# Altium schematic sheet Regulator.SchDoc: Regulator
size A4; Organization: Energy Auditor; Address1: Sensor Node; Address3: University of Colorado; Address4: Boulder; DocumentNumber: 3; Revision: 1; SheetNumber: 3; SheetTotal: 6
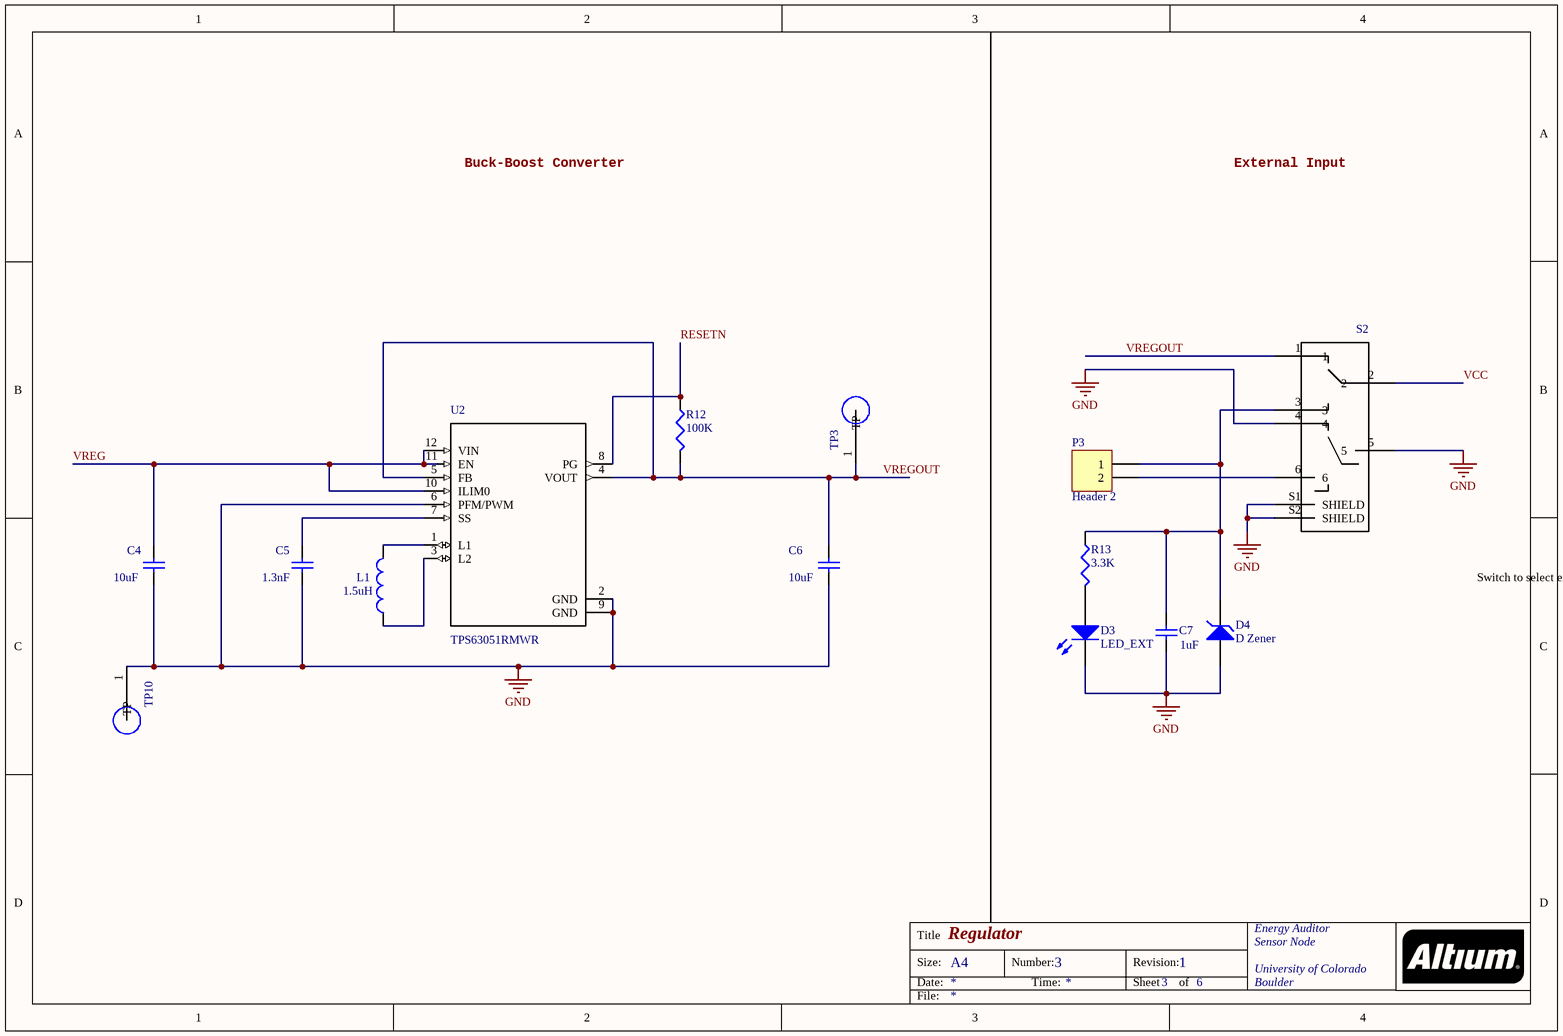
[diagram p0: Regulator.SchDoc]

## Parts
C4  10uF  [1608[0603]]
C5  1.3nF  [1608[0603]]
C6  10uF  [1608[0603]]
C7  1uF  [1608[0603]]
D3  LED_EXT  [3.2X1.6X1.1]
D4  D Zener  [0402]
L1  1.5uH  [0603]
P3  Header 2  [HDR1X2]
R12  100K  [1608[0603]]
R13  3.3K  [1608[0603]]
S2  1825289-1  [SW_1825289-1_1825289-1(Primary)]  (value not drawn)
TP3  5019  [TP380X203]  (value not drawn)
TP10  5019  [TP380X203]  (value not drawn)
U2  TPS63051RMWR  [QFN50P250X250X100-12N]

## Nets
GND: C4.1 C5.1 C6.1 C7.1 D3.2(K) D4.1(A) S2.4 S2.5 S2.S1(SHIELD) S2.S2(SHIELD) TP10.1(TP) U2.2(GND) U2.6(PFM/PWM) U2.9(GND)
RESETN: R12.1 U2.8(PG)
VCC: S2.2
VREG: C4.2 U2.10(ILIM0) U2.11(EN) U2.12(VIN)
VREGOUT: C6.2 R12.2 S2.1 TP3.1(TP) U2.4(VOUT) U2.5(FB)
NetC5_2: C5.2 U2.7(SS)
NetC7_2: C7.2 D4.2(K) P3.1 R13.2 S2.3
NetD3_1: D3.1(A) R13.1
NetL1_1: L1.1 U2.3(L2)
NetL1_2: L1.2 U2.1(L1)
NetP3_2: P3.2 S2.6

## Notes on the sheet
- Buck-Boost Converter
- External Input
- Switch to select external supply
- Title
- Size:
- Date:
- A4
- Number:
- Time:
- Revision:
- Sheet
- of
- File:

## Library data of the parts
C4 C6 = Cap: CAP CER 10UF 10V X5R 0603; Manufacturer: Murata Electronics North America; Manufacturer Part Number: GRM188R61A106KE69D; Value: 10uF; ComponentLink1URL: https://www.digikey.com/products/en?keywords=490-10474-1-ND; ComponentLink1Description: Digi-Key Link; Digi-Key Part Number: 490-10474-1-ND
C5 = Cap: CAP CER 1300PF 25V C0G/NP0 0603; Manufacturer: KEMET; Manufacturer Part Number: C0603C132J3GAC7867; Value: 1.3nF; ComponentLink1URL: https://www.digikey.com/product-detail/en/kemet/C0603C132J3GAC7867/399-14953-1-ND/7382502; ComponentLink1Description: Digi-Key Link; Digi-Key Part Number: 399-14953-1-ND
C7 = Cap: CAP CER 1UF 16V X7R 0603; Manufacturer: Samsung Electro-Mechanics; Manufacturer Part Number: CL10B105MO8NNWC; Value: 1uF; Digi-Key Part Number: 1276-6524-1-ND; ComponentLink1URL: https://www.digikey.com/product-detail/en/samsung-electro-mechanics/CL10B105MO8NNWC/1276-6524-1-ND/5961383; ComponentLink1Description: Digi-Key Link
D3 = LED2: LED GREEN DIFFUSED 0603 SMD; Manufacturer: OSRAM Opto Semiconductors Inc.; Manufacturer Part Number: LG L29K-F2J1-24-Z; Digi-Key Part Number: 475-3118-1-ND; ComponentLink1URL: https://www.digikey.com/product-detail/en/osram-opto-semiconductors-inc/LG-L29K-F2J1-24-Z/475-3118-1-ND/4899549; ComponentLink1Description: Digi-Key Link
D4 = D Zener: TVS DIODE 5.5V 14V 2X1SON; Manufacturer Part Number: TPD1E10B06DPYR; Manufacturer: Texas Instruments; ComponentLink1URL: https://www.digikey.com/product-detail/en/texas-instruments/TPD1E10B06DPYR/296-30406-1-ND/3283560; ComponentLink1Description: Digi-Key Link; Value: *; Digi-Key Part Number: 296-30406-1-ND
L1 = Inductor: FIXED IND 1.5UH 1.1A 213 MOHM; Manufacturer: Murata Electronics North America; Manufacturer Part Number: LQM18PN1R5MFHD; Value: 1.5uH; Digi-Key Part Number: 490-15637-1-ND; ComponentLink1URL: https://www.digikey.com/product-detail/en/murata-electronics-north-america/LQM18PN1R5MFHD/490-15637-1-ND/6800302; ComponentLink1Description: Digi-Key Link
P3 = Header 2: Header, 2-Pin
R12 = Res3: RES SMD 100K OHM 0.1% 1/10W 0603; Manufacturer: Susumu; Manufacturer Part Number: RG1608P-104-B-T5; Value: 100K; Digi-Key Part Number: RG16P100KBCT-ND; ComponentLink1URL: https://www.digikey.com/products/en/resistors/chip-resistor-surface-mount/52?k=RG1608P-104-B-T5&k=&pkeyword=RG1608P-104-B-T5&pv7=2&sf=0&quantity=&ColumnSort=0&page=1&pageSize=25; ComponentLink1Description: Digi-Key Link
R13 = Res3: RES SMD 3.3K OHM 5% 1/10W 0603; Manufacturer: Panasonic Electronic Components; Manufacturer Part Number: ERJ-3GEYJ332V; Value: 3.3K; Digi-Key Part Number: P3.3KGCT-ND; ComponentLink1URL: https://www.digikey.com/product-detail/en/panasonic-electronic-components/ERJ-3GEYJ332V/P3.3KGCT-ND/135146; ComponentLink1Description: Digi-Key Link
S2 = 1825289-1: MHS22204=DPDT SL SW VERT AG; Manufacturer: TE Connectivity; Manufacturer Part Number: 1825289-1; ComponentLink1URL: https://www.digikey.com/products/en?keywords=MHS22204; ComponentLink1Description: Digi-Key Link; Digi-Key Part Number: 450-1572-ND
TP3 TP10 = 5019: Phosphor Bronze Contact Miniature Silver Plated Surface Mount Test Points; Manufacturer: Keystone; Manufacturer Part Number: 5019; Digi-Key Part Number: 36-5019CT-ND; ComponentLink1URL: https://www.digikey.com/product-detail/en/keystone-electronics/5019/36-5019CT-ND/3907344?utm_source=snapeda&utm_medium=aggregator&utm_campaign=symbol; Value: *; ComponentLink1Description: Digi-Key Link
U2 = TPS63051RMWR: Tiny Single Inductor Buck Boost Converter 12-VQFN -40 to 85; Manufacturer: Texas Instruments; Manufacturer Part Number: TPS63051RMWR; Value: *; Digi-Key Part Number: 296-42650-1-ND; ComponentLink1URL: https://www.digikey.com/products/en/integrated-circuits-ics/pmic-voltage-regulators-dc-dc-switching-regulators/739?k=TPS63051RMWR&k=&pkeyword=TPS63051RMWR&pv7=2&sf=0&quantity=&ColumnSort=0&page=1&pageSize=25; ComponentLink1Description: Digi-Key Link